# Altium project SVPXFMC_Carrier_6U.PrjPcb (part 1 of 9)
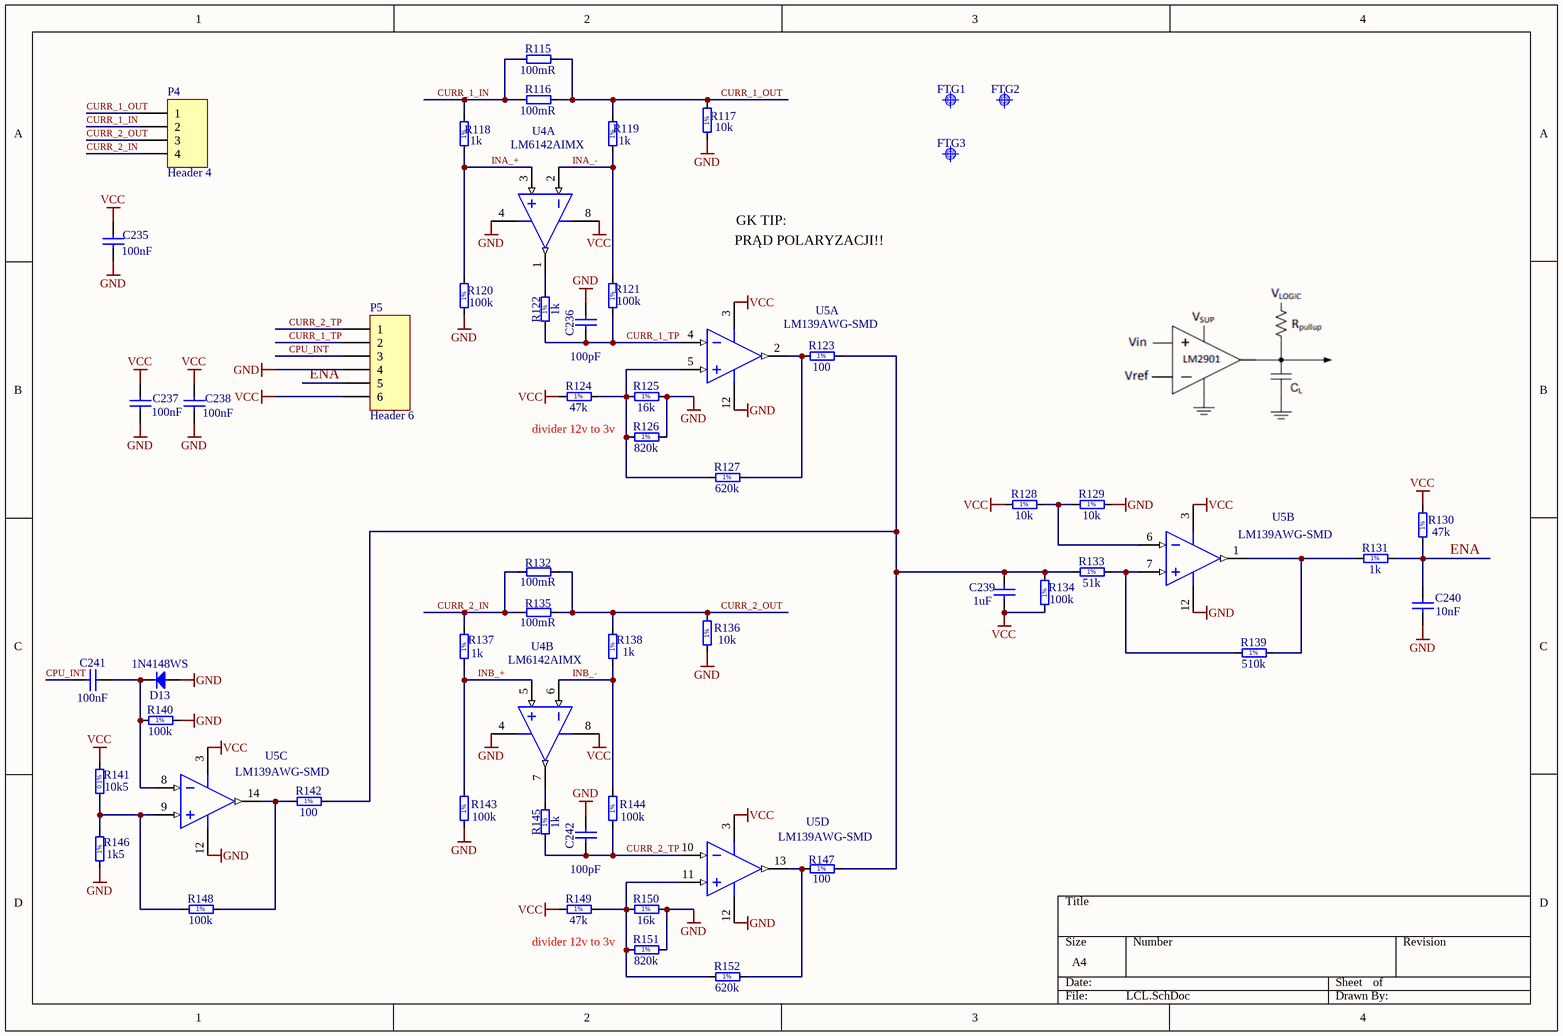
[diagram p0: LCL.SchDoc]
ProjectAddress1: IBP Shanghai; ProjectAddress2: Level 3 - Building 3; ProjectAddress3: No.168 Linhong Road; ProjectAddress4: Shanghai 200335, China; ProjectOrganization: Altium; ProjectTitle: VPX 6U; Template Family: VPX; Template Notes: - Nominal values used, all dimensions are mm.  - Stackup is not specified in AV46DOT0.PDF, nor implemented in this template.  - The component height constraint is defined in AV46DOT0.pdf, page 90.; Template Revision Date: May 2011; Template Source Document: AV46DOT0.pdf; Template Source Name: ANSI/VITA 46.0-2007; Template Source Organization: VITA; Template Source Revision Date: Oct-2007; Template Source URL: www.vita.com
22 sheets, 996 parts. Net scope: hierarchical (ports join the sheet entries above them; power ports are global).
Board file: SVPXFMC_Carrier_6U.PcbDoc
Sheets:
  LCL.SchDoc
  LCL_sch.SchDoc
  SVPXFMC_Carrier_6U.SchDoc
    FMC Carrier Channel1 = FMC_Carrier_channel.SchDoc
      U_FMC_connector = FMC_connector.SchDoc
      FPGA_FMC = FPGA_FMC.SchDoc
      FPGA_RGMII_Misc = FPGA_RGMII_Misc.SchDoc
      FPGA_MGT = FPGA_MGT.SchDoc
      Supply for FPGA, FMC and SDRAM = Channel_supply.SchDoc
      U_FPGA SDRAM bank = FPGA SDRAM bank.SchDoc
      U_FPGA Supply = FPGA Supply.SchDoc
      U_DDR4 SDRAM = DDR4 SDRAM.SchDoc
      FPGA config = FPGA_Config.SchDoc
      U_Decoupling_caps = Decoupling_caps.SchDoc
      U_CAN_IFC = CAN_IFC.SchDoc
    FMC Carrier Channel2 = FMC_Carrier_channel.SchDoc
      U_FMC_connector = FMC_connector.SchDoc
      FPGA_FMC = FPGA_FMC.SchDoc
      FPGA_RGMII_Misc = FPGA_RGMII_Misc.SchDoc
      FPGA_MGT = FPGA_MGT.SchDoc
      Supply for FPGA, FMC and SDRAM = Channel_supply.SchDoc
      U_FPGA SDRAM bank = FPGA SDRAM bank.SchDoc
      U_FPGA Supply = FPGA Supply.SchDoc
      U_DDR4 SDRAM = DDR4 SDRAM.SchDoc
      FPGA config = FPGA_Config.SchDoc
      U_Decoupling_caps = Decoupling_caps.SchDoc
      U_CAN_IFC = CAN_IFC.SchDoc
    U_HDN_Control_Data = HDN_Control_Data.SchDoc
    U_HDN_Management = HDN_Management.SchDoc
    U_MSP_Telemetry = MSP_Telemetry.SchDoc
      U_MSP_Power_Program = MSP_Power_Program.SchDoc
    Module supply = Module_Supply.SchDoc
    U_FRAM_memory = FRAM_memory.SchDoc
    Interface_prot_A = Interface_Protection.SchDoc
    Interface_prot_B = Interface_Protection.SchDoc

## Sheet LCL.SchDoc: NIC POWER LCL prototype
size A4; DrawnBy: Marcin Bieda, Daniel Kaczmara; Revision: 1.0

### Parts
C235  100nF  [CAPC1608X87N]
C236  100pF  [CAPC1608X87N]
C237  100nF  [CAPC1608X87N]
C238  100nF  [CAPC1608X87N]
C239  1uF  [CAPC1608X87N]
C240  10nF  [CAPC1608X87N]
C241  100nF  [CAPC1608X87N]
C242  100pF  [CAPC1608X87N]
D13  1N4148WS  [SODFL2512X100N]
FTG1  Use only in PCB  [FIDUCIAL_TOP_C100-200]  (value not drawn)
FTG2  Use only in PCB  [FIDUCIAL_TOP_C100-200]  (value not drawn)
FTG3  Use only in PCB  [FIDUCIAL_TOP_C100-200]  (value not drawn)
P4  Header 4  [1x4 Header 2mm male]
P5  Header 6  [2x3 Header 2mm male]
R115  100mR  [RESC1608X55N]
R116  100mR  [RESC1608X55N]
R117  10k  [RESC1608X55N]
R118  1k  [RESC1608X55N]
R119  1k  [RESC1608X55N]
R120  100k  [RESC1608X55N]
R121  100k  [RESC1608X55N]
R122  1k  [RESC1608X55N]
R123  100  [RESC1608X55N]
R124  47k  [RESC1608X55N]
R125  16k  [RESC1608X55N]
R126  820k  [RESC1608X55N]
R127  620k  [RESC1608X55N]
R128  10k  [RESC1608X55N]
R129  10k  [RESC1608X55N]
R130  47k  [RESC1608X55N]
R131  1k  [RESC1608X55N]
R132  100mR  [RESC1608X55N]
R133  51k  [RESC1608X55N]
R134  100k  [RESC1608X55N]
R135  100mR  [RESC1608X55N]
R136  10k  [RESC1608X55N]
R137  1k  [RESC1608X55N]
R138  1k  [RESC1608X55N]
R139  510k  [RESC1608X55N]
R140  100k  [RESC1608X55N]
R141  10k5  [RESC1608X55N]
R142  100  [RESC1608X55N]
R143  100k  [RESC1608X55N]
R144  100k  [RESC1608X55N]
R145  1k  [RESC1608X55N]
R146  1k5  [RESC1608X55N]
R147  100  [RESC1608X55N]
R148  100k  [RESC1608X55N]
R149  47k  [RESC1608X55N]
R150  16k  [RESC1608X55N]
R151  820k  [RESC1608X55N]
R152  620k  [RESC1608X55N]
U4  LM6142AIMX  [M08A_N]  (parts A,B of 2)
U5  LM139AWG-SMD  [WG14A_N]  (parts A,B,C,D of 4)

### Nets
GND: C235.1 C236.2 C237.1 C238.1 C240.1 C242.2 D13.2(A) P5.4 R117.1 R120.1 R125.2 R126.2 R129.2 R136.1 R140.2 R143.1 R146.1 R150.2 R151.2 U4.4(V-) U5.12(GND)
VCC: C235.2 C237.2 C238.2 C239.1 P5.6 R124.1 R128.1 R130.2 R134.1 R141.2 R149.1 U4.8(V+) U5.3(V+)
CPU_INT: C241.1 P5.3
CURR_1_IN: P4.2 R115.1 R116.1 R118.2
CURR_1_OUT: P4.1 R115.2 R116.2 R117.2 R119.2
CURR_1_TP: C236.1 P5.2 R121.1 R122.1 U5.4(IN1-)
CURR_2_IN: P4.4 R132.1 R135.1 R137.2
CURR_2_OUT: P4.3 R132.2 R135.2 R136.2 R138.2
CURR_2_TP: C242.1 P5.1 R144.1 R145.1 U5.10(IN4-)
ENA: C240.2 P5.5 R130.1 R131.2
INA_+: R118.1 R120.2 U4.3(INA+)
INA_-: R119.1 R121.2 U4.2(INA-)
INB_+: R137.1 R143.2 U4.5(INB+)
INB_-: R138.1 R144.2 U4.6(INB-)
NetC239_2: C239.2 R123.2 R133.1 R134.2 R142.2 R147.2
NetC241_2: C241.2 D13.1(C) R140.1 U5.8(IN3-)
NetR122_2: R122.2 U4.1(OUTA)
NetR123_1: R123.1 R127.2 U5.2(OUT1)
NetR124_2: R124.2 R125.1 R126.1 R127.1 U5.5(IN1+)
NetR128_2: R128.2 R129.1 U5.6(IN2-)
NetR131_1: R131.1 R139.2 U5.1(OUT2)
NetR133_2: R133.2 R139.1 U5.7(IN2+)
NetR141_1: R141.1 R146.2 R148.1 U5.9(IN3+)
NetR142_1: R142.1 R148.2 U5.14(OUT3)
NetR145_2: R145.2 U4.7(OUTB)
NetR147_1: R147.1 R152.2 U5.13(OUT4)
NetR149_2: R149.2 R150.1 R151.1 R152.1 U5.11(IN4+)

### Notes on the sheet
- PRĄD POLARYZACJI!!
- GK TIP:
- (near R126) divider 12v to 3v
- (near R151) divider 12v to 3v
- (in symbol R0603_1K5_1%_0.1W_100PPM) 1%
- (in symbol R0603_1K_1%_0.1W_100PPM) 1%
- (in symbol R0603_10K5_0.1%_0.063W_10PPM) 0.1%
- (in symbol R0603_10K_1%_0.1W_100PPM) 1%
- (in symbol R0603_16K_1%_0.1W_100PPM) 1%
- (in symbol R0603_47K_1%_0.1W_100PPM) 1%
- (in symbol R0603_51K_1%_0.1W_100PPM) 1%
- (in symbol R0603_100K_1%_0.1W_100PPM) 1%
- (in symbol R0603_100R_1%_0.1W_100PPM) 1%
- (in symbol R0603_510K_1%_0.1W_100PPM) 1%
- (in symbol R0603_620K_1%_0.1W_100PPM) 1%
- (in symbol R0603_820K_1%_0.1W_100PPM) 1%

### Library data of the parts
C235 C237 C238 C241 = CC0603_100NF_50V_10%_X7R: Non-polarised capacitor; Part Description: SMD Multilayer Chip Ceramic Capacitor; Manufacturer: GENERIC; Manufacturer1 Part Number: 223858615649; Voltage: 50V; TC: X7R; Tolerance: ±10%; Part Number: CC0603_100NF_50V_10%_X7R; Component Kind: Standard; Component Type: Standard; Pin Count: 2; Value: 100nF; Status: Preferred; Manufacturer Part Number: CC0603_100NF_50V_10%_X7R; Case: 0603; Mounted: Yes; Socket: No; SMD: Yes; Sense: No; Manufacturer1 Example: PHYCOMP; Manufacturer1 ComponentHeight: 0.87mm; HelpURL: \\cern.ch\dfs\Applications\Altium\Datasheets\CC0603_X7R_PHYCOMP.pdf; Author: CERN DEM JLC; CreateDate: 2007-12-03; LatestRevisionDate: 2007-12-03
C236 C242 = CC0603_100PF_50V_10%_X7R: Non-polarised capacitor; Part Description: SMD Multilayer Chip Ceramic Capacitor; Manufacturer: GENERIC; Manufacturer1 Part Number: 223858615609; Voltage: 50V; TC: X7R; Tolerance: ±10%; Part Number: CC0603_100PF_50V_10%_X7R; Component Kind: Standard; Component Type: Standard; Pin Count: 2; Value: 100pF; Status: Preferred; Manufacturer Part Number: CC0603_100PF_50V_10%_X7R; Case: 0603; Mounted: Yes; Socket: No; SMD: Yes; Sense: No; Manufacturer1 Example: PHYCOMP; Manufacturer1 ComponentHeight: 0.9mm; HelpURL: \\cern.ch\dfs\Applications\Altium\Datasheets\CC0603_X7R_PHYCOMP.pdf; Author: CERN DEM JLC; CreateDate: 2012-08-15; LatestRevisionDate: 2012-08-15
C239 = CC0603_1UF_25V_10%_X7R: Non-polarised capacitor; Part Description: SMD Multilayer Chip Ceramic Capacitor; Manufacturer: GENERIC; Manufacturer1 Part Number: GRM188R71E105KA12D; Voltage: 25V; TC: X7R; Tolerance: ±10%; Part Number: CC0603_1UF_25V_10%_X7R; Component Kind: Standard; Component Type: Standard; Pin Count: 2; Value: 1uF; Status: None; Manufacturer Part Number: CC0603_1UF_25V_10%_X7R; Case: 0603; Mounted: Yes; Socket: No; SMD: Yes; Sense: No; Manufacturer1 Example: MURATA; Manufacturer1 ComponentHeight: 0.9mm; HelpURL: \\cern.ch\dfs\Applications\Altium\Datasheets\CC0603_X7R_MURATA.pdf; Author: CERN DEM JLC; CreateDate: 2011-01-18; LatestRevisionDate: 2011-01-18
C240 = CC0603_10NF_50V_10%_X7R: Non-polarised capacitor; Part Description: SMD Multilayer Chip Ceramic Capacitor; Manufacturer: GENERIC; Manufacturer1 Part Number: 223858615636; Voltage: 50V; TC: X7R; Tolerance: ±10%; Part Number: CC0603_10NF_50V_10%_X7R; Component Kind: Standard; Component Type: Standard; Pin Count: 2; Value: 10nF; Status: Preferred; Manufacturer Part Number: CC0603_10NF_50V_10%_X7R; Case: 0603; Mounted: Yes; Socket: No; SMD: Yes; Sense: No; Manufacturer1 Example: PHYCOMP; Manufacturer1 ComponentHeight: 0.87mm; HelpURL: \\cern.ch\dfs\Applications\Altium\Datasheets\CC0603_X7R_PHYCOMP.pdf; Author: CERN DEM JLC; CreateDate: 2007-12-03; LatestRevisionDate: 2007-12-03
D13 = 1N4148WS: Diode; Part Description: Small Signal Diodes; Manufacturer: FAIRCHILD SEMICONDUCTOR; Voltage: 75V; Power: 150mA; PressFit: No; Bonding: No; Part Number: 1N4148WS; Component Kind: Standard; Component Type: Standard; Device: 1N4148WS; PackageDescription: SODFL Diode; 1.70mm W X 1.25mm L X 1.00mm H body, IPC Medium Density; Manufacturer Part Number: 1N4148WS; Pin Count: 2; Case: SOD-323F; Mounted: Yes; Socket: No; SMD: Yes; Sense: No; ComponentHeight: 1mm; HelpURL: \\cern.ch\dfs\Applications\Altium\Datasheets\1N4148WS.pdf; Author: CERN DEM JLC; CreateDate: 2011-05-12; LatestRevisionDate: 2011-05-12
FTG1-FTG3 = FIDUCIAL_TARGET_C100-200: Fiducial Target; Part Description: Round Fiducial Target, Top Layer, 1.0mm, Top Solder 2.0mm, Keepout =2.0mm; Mounted: No; Part Number: FIDUCIAL_TARGET_C100-200; Component Kind: Standard (No BOM); Component Type: Standard (No BOM); Pin Count: 1; Family: Fiducial; Socket: No; SMD: Yes; Sense: No; Status: None; ComponentHeight: 0mm; HelpURL: Undefined; Author: CERN DEM JLC; CreateDate: 2010-02-09; LatestRevisionDate: 2012-04-04; PackageDescription: Round Fiducial Target, Top Layer, 1.0mm, Top Solder 2.0mm, Keepout =2.0mm
P4 = Header 4: Header, 4-Pin; LatestRevisionDate: 17-Jul-2002; LatestRevisionNote: Re-released for DXP Platform.; Publisher: Altium Limited
P5 = Header 6: Header, 6-Pin; LatestRevisionDate: 17-Jul-2002; LatestRevisionNote: Re-released for DXP Platform.; Publisher: Altium Limited
R115 R116 R132 R135 = R0603_0R_JUMPER: Resistor; Part Number: 100mR 0603; Part Description: 1A (0.05R Max DC Resistance) Zero Ohm Jumper; Manufacturer: GENERIC; Manufacturer1 Part Number: NRC06Z0; Value: 0; PressFit: No; Component Kind: Standard; Component Type: Standard; Pin Count: 2; Status: Preferred; Manufacturer Part Number: R0603_0R_JUMPER; Case: 0603; Mounted: Yes; Sense: No; Socket: No; SMD: Yes; Manufacturer1 Example: NIC COMPONENT; Manufacturer1 ComponentHeight: 0.55mm; HelpURL: \\cern.ch\dfs\Applications\Altium\Datasheets\R0603_NIC_NRC.pdf; Author: CERN DEM JLC; CreateDate: 2007-12-03; LatestRevisionDate: 2008-03-13
R117 R128 R129 R136 = R0603_10K_1%_0.1W_100PPM: Resistor - 1%; Part Description: General Purpose Thick Film Chip Resistor; Manufacturer: GENERIC; Manufacturer1 Part Number: NRC06F1002TRF; Power: 0.1W; TC: ±100ppm/°C; PressFit: No; Part Number: R0603_10K_1%_0.1W_100PPM; Component Kind: Standard; Component Type: Standard; Pin Count: 2; Value: 10k; Status: Preferred; Tolerance: ±1%; Manufacturer Part Number: R0603_10K_1%_0.1W_100PPM; Case: 0603; Mounted: Yes; Sense: No; Socket: No; SMD: Yes; Manufacturer1 Example: NIC COMPONENT; Manufacturer1 ComponentHeight: 0.55mm; HelpURL: \\cern.ch\dfs\Applications\Altium\Datasheets\R0603_NIC_NRC.pdf; Author: CERN DEM JLC; CreateDate: 2007-12-03; LatestRevisionDate: 2008-03-13
R118 R119 R122 R131 R137 R138 R145 = R0603_1K_1%_0.1W_100PPM: Resistor - 1%; Part Description: General Purpose Thick Film Chip Resistor; Manufacturer: GENERIC; Manufacturer1 Part Number: NRC06F1001TRF; Power: 0.1W; TC: ±100ppm/°C; PressFit: No; Part Number: R0603_1K_1%_0.1W_100PPM; Component Kind: Standard; Component Type: Standard; Pin Count: 2; Value: 1k; Status: Preferred; Tolerance: ±1%; Manufacturer Part Number: R0603_1K_1%_0.1W_100PPM; Case: 0603; Mounted: Yes; Sense: No; Socket: No; SMD: Yes; Manufacturer1 Example: NIC COMPONENT; Manufacturer1 ComponentHeight: 0.55mm; HelpURL: \\cern.ch\dfs\Applications\Altium\Datasheets\R0603_NIC_NRC.pdf; Author: CERN DEM JLC; CreateDate: 2007-12-03; LatestRevisionDate: 2008-03-13
R120 R121 R134 R140 R143 R144 R148 = R0603_100K_1%_0.1W_100PPM: Resistor - 1%; Part Description: General Purpose Thick Film Chip Resistor; Manufacturer: GENERIC; Manufacturer1 Part Number: NRC06F1003TRF; Power: 0.1W; TC: ±100ppm/°C; PressFit: No; Part Number: R0603_100K_1%_0.1W_100PPM; Component Kind: Standard; Component Type: Standard; Pin Count: 2; Value: 100k; Status: Preferred; Tolerance: ±1%; Manufacturer Part Number: R0603_100K_1%_0.1W_100PPM; Case: 0603; Mounted: Yes; Sense: No; Socket: No; SMD: Yes; Manufacturer1 Example: NIC COMPONENT; Manufacturer1 ComponentHeight: 0.55mm; HelpURL: \\cern.ch\dfs\Applications\Altium\Datasheets\R0603_NIC_NRC.pdf; Author: CERN DEM JLC; CreateDate: 2007-12-03; LatestRevisionDate: 2008-03-13
R123 R142 R147 = R0603_100R_1%_0.1W_100PPM: Resistor - 1%; Part Description: General Purpose Thick Film Chip Resistor; Manufacturer: GENERIC; Manufacturer1 Part Number: NRC06F4700TRF; Power: 0.1W; TC: ±100ppm/°C; PressFit: No; Part Number: R0603_100R_1%_0.1W_100PPM; Component Kind: Standard; Component Type: Standard; Pin Count: 2; Value: 100; Status: Preferred; Tolerance: ±1%; Manufacturer Part Number: R0603_100R_1%_0.1W_100PPM; Case: 0603; Mounted: Yes; Sense: No; Socket: No; SMD: Yes; Manufacturer1 Example: NIC COMPONENT; Manufacturer1 ComponentHeight: 0.55mm; HelpURL: \\cern.ch\dfs\Applications\Altium\Datasheets\R0603_NIC_NRC.pdf; Author: CERN DEM JLC; CreateDate: 2007-12-03; LatestRevisionDate: 2008-03-13
R124 R130 R149 = R0603_47K_1%_0.1W_100PPM: Resistor - 1%; Part Description: General Purpose Thick Film Chip Resistor; Manufacturer: GENERIC; Manufacturer1 Part Number: NRC06F4702TRF; Power: 0.1W; TC: ±100ppm/°C; PressFit: No; Part Number: R0603_47K_1%_0.1W_100PPM; Component Kind: Standard; Component Type: Standard; Pin Count: 2; Value: 47k; Status: Preferred; Tolerance: ±1%; Manufacturer Part Number: R0603_47K_1%_0.1W_100PPM; Case: 0603; Mounted: Yes; Sense: No; Socket: No; SMD: Yes; Manufacturer1 Example: NIC COMPONENT; Manufacturer1 ComponentHeight: 0.55mm; HelpURL: \\cern.ch\dfs\Applications\Altium\Datasheets\R0603_NIC_NRC.pdf; Author: CERN DEM JLC; CreateDate: 2007-12-03; LatestRevisionDate: 2008-03-13
R125 R150 = R0603_16K_1%_0.1W_100PPM: Resistor - 1%; Part Description: General Purpose Thick Film Chip Resistor; Manufacturer: GENERIC; Manufacturer1 Part Number: NRC06F1602TRF; Power: 0.1W; TC: ±100ppm/°C; PressFit: No; Part Number: R0603_16K_1%_0.1W_100PPM; Component Kind: Standard; Component Type: Standard; Pin Count: 2; Value: 16k; Status: Preferred; Tolerance: ±1%; Manufacturer Part Number: R0603_16K_1%_0.1W_100PPM; Case: 0603; Mounted: Yes; Sense: No; Socket: No; SMD: Yes; Manufacturer1 Example: NIC COMPONENT; Manufacturer1 ComponentHeight: 0.55mm; HelpURL: \\cern.ch\dfs\Applications\Altium\Datasheets\R0603_NIC_NRC.pdf; Author: CERN DEM JLC; CreateDate: 2007-12-03; LatestRevisionDate: 2008-03-13
R126 R151 = R0603_820K_1%_0.1W_100PPM: Resistor - 1%; Part Description: General Purpose Thick Film Chip Resistor; Manufacturer: GENERIC; Manufacturer1 Part Number: NRC06F8203TRF; Power: 0.1W; TC: ±100ppm/°C; PressFit: No; Part Number: R0603_820K_1%_0.1W_100PPM; Component Kind: Standard; Component Type: Standard; Pin Count: 2; Value: 820k; Status: Preferred; Tolerance: ±1%; Manufacturer Part Number: R0603_820K_1%_0.1W_100PPM; Case: 0603; Mounted: Yes; Sense: No; Socket: No; SMD: Yes; Manufacturer1 Example: NIC COMPONENT; Manufacturer1 ComponentHeight: 0.55mm; HelpURL: \\cern.ch\dfs\Applications\Altium\Datasheets\R0603_NIC_NRC.pdf; Author: CERN DEM JLC; CreateDate: 2007-12-03; LatestRevisionDate: 2008-03-13
R127 R152 = R0603_620K_1%_0.1W_100PPM: Resistor - 1%; Part Description: General Purpose Thick Film Chip Resistor; Manufacturer: GENERIC; Manufacturer1 Part Number: NRC06F6203TRF; Power: 0.1W; TC: ±100ppm/°C; PressFit: No; Part Number: R0603_620K_1%_0.1W_100PPM; Component Kind: Standard; Component Type: Standard; Pin Count: 2; Value: 620k; Status: Preferred; Tolerance: ±1%; Manufacturer Part Number: R0603_620K_1%_0.1W_100PPM; Case: 0603; Mounted: Yes; Sense: No; Socket: No; SMD: Yes; Manufacturer1 Example: NIC COMPONENT; Manufacturer1 ComponentHeight: 0.55mm; HelpURL: \\cern.ch\dfs\Applications\Altium\Datasheets\R0603_NIC_NRC.pdf; Author: CERN DEM JLC; CreateDate: 2007-12-03; LatestRevisionDate: 2008-03-13
R133 = R0603_51K_1%_0.1W_100PPM: Resistor - 1%; Part Description: General Purpose Thick Film Chip Resistor; Manufacturer: GENERIC; Manufacturer1 Part Number: NRC06F5102TRF; Power: 0.1W; TC: ±100ppm/°C; PressFit: No; Part Number: R0603_51K_1%_0.1W_100PPM; Component Kind: Standard; Component Type: Standard; Pin Count: 2; Value: 51k; Status: Preferred; Tolerance: ±1%; Manufacturer Part Number: R0603_51K_1%_0.1W_100PPM; Case: 0603; Mounted: Yes; Sense: No; Socket: No; SMD: Yes; Manufacturer1 Example: NIC COMPONENT; Manufacturer1 ComponentHeight: 0.55mm; HelpURL: \\cern.ch\dfs\Applications\Altium\Datasheets\R0603_NIC_NRC.pdf; Author: CERN DEM JLC; CreateDate: 2007-12-03; LatestRevisionDate: 2008-03-13
R139 = R0603_510K_1%_0.1W_100PPM: Resistor - 1%; Part Description: General Purpose Thick Film Chip Resistor; Manufacturer: GENERIC; Manufacturer1 Part Number: NRC06F5103TRF; Power: 0.1W; TC: ±100ppm/°C; PressFit: No; Part Number: R0603_510K_1%_0.1W_100PPM; Component Kind: Standard; Component Type: Standard; Pin Count: 2; Value: 510k; Status: Preferred; Tolerance: ±1%; Manufacturer Part Number: R0603_510K_1%_0.1W_100PPM; Case: 0603; Mounted: Yes; Sense: No; Socket: No; SMD: Yes; Manufacturer1 Example: NIC COMPONENT; Manufacturer1 ComponentHeight: 0.55mm; HelpURL: \\cern.ch\dfs\Applications\Altium\Datasheets\R0603_NIC_NRC.pdf; Author: CERN DEM JLC; CreateDate: 2007-12-03; LatestRevisionDate: 2008-03-13
R141 = R0603_10K5_0.1%_0.063W_10PPM: Resistor - 0.1%; Part Description: Thin Film Chip Resistor; Manufacturer: GENERIC; Manufacturer1 Part Number: RN73C1J10K5BTDF; Power: 0.063W; TC: ±10ppm; PressFit: No; Part Number: R0603_10K5_0.1%_0.063W_10PPM; Component Kind: Standard; Component Type: Standard; Pin Count: 2; Value: 10k5; Status: Not Recommended; Tolerance: ±0.1%; Manufacturer Part Number: R0603_10K5_0.1%_0.063W_10PPM; Case: 0603; Mounted: Yes; Sense: No; Socket: No; SMD: Yes; Manufacturer1 Example: TYCO HOLSWORTHY; Manufacturer1 ComponentHeight: 0.5mm; HelpURL: \\cern.ch\dfs\Applications\Altium\Datasheets\R0603_Tyco_RN73.pdf; Author: CERN DEM JLC; CreateDate: 2007-12-03; LatestRevisionDate: 2008-03-13
R146 = R0603_1K5_1%_0.1W_100PPM: Resistor - 1%; Part Description: General Purpose Thick Film Chip Resistor; Manufacturer: GENERIC; Manufacturer1 Part Number: NRC06F1501TRF; Power: 0.1W; TC: ±100ppm/°C; PressFit: No; Part Number: R0603_1K5_1%_0.1W_100PPM; Component Kind: Standard; Component Type: Standard; Pin Count: 2; Value: 1k5; Status: Preferred; Tolerance: ±1%; Manufacturer Part Number: R0603_1K5_1%_0.1W_100PPM; Case: 0603; Mounted: Yes; Sense: No; Socket: No; SMD: Yes; Manufacturer1 Example: NIC COMPONENT; Manufacturer1 ComponentHeight: 0.55mm; HelpURL: \\cern.ch\dfs\Applications\Altium\Datasheets\R0603_NIC_NRC.pdf; Author: CERN DEM JLC; CreateDate: 2007-12-03; LatestRevisionDate: 2008-03-13
U4 = LM6142AIMX: Dual High Speed/Low Power 17 MHz Rail-to-Rail I/O Operational Amplifier, 8-pin Narrow SOIC; Manufacturer: National Semiconductor; PackageTopMarking: NSZXTT*LM614*2AIM; PowerWise: N; CompType: Amplifiers; High-Reliability: Y; DatasheetVersion: Nov-2004; PackageVersion: revM, May-2009; PackageReference: M08A; PackageDescription: SOIC Narrow, 4.9 x 3.9 x 1.45mm, 8 Lead, 1.27mm Pitch; PartNumber: LM6142AIMX; RoHS: N; PinCount: 8; Code_JEDEC: MS-012-AA; Code_IPC: SOIC127P600-8; ComponentLink1Description: Manufacturer URL; ComponentLink1URL: http://www.national.com/; ComponentLink2Description: LM6142 Datasheet; ComponentLink2URL: http://www.national.com/ds/LM/LM6142.pdf; ComponentLink3Description: LM6142 Web Page; ComponentLink3URL: http://www.national.com/pf/LM/LM6142.html; ComponentLink4Description: M08A Package Page; ComponentLink4URL: http://www.national.com/packaging/folders/m08a.html
U5 = LM139AWG-SMD: Low Power Low Offset Voltage Quad Comparator, 14-pin CerPACK; Manufacturer: National Semiconductor; PackageTopMarking: NSZSSXXYYA*5962-*8773901XA Q; PowerWise: N; CompType: Amplifiers; High-Reliability: Y; DatasheetVersion: Mar-2004; PackageVersion: revD, Jul-2007; PackageReference: WG14A; PackageDescription: Cerpack, .390 x .250 x .070in, 14 Lead, .050in Pitch, Gull Wing; PartNumber: LM139AWG-SMD; RoHS: N; PinCount: 14; ComponentLink1Description: Manufacturer URL; ComponentLink1URL: http://www.national.com/; ComponentLink2Description: LM139A Datasheet; ComponentLink2URL: http://www.national.com/ds/LM/LM139AQML.pdf; ComponentLink3Description: LM139A Web Page; ComponentLink3URL: http://www.national.com/pf/LM/LM139A.html; ComponentLink4Description: WG14A Package Page; ComponentLink4URL: http://www.national.com/packaging/folders/wg14a.html

## Sheet LCL_sch.SchDoc: NIC POWER LCL prototype
size A4; DrawnBy: Marcin Bieda, Daniel Kaczmara; Revision: 1.0
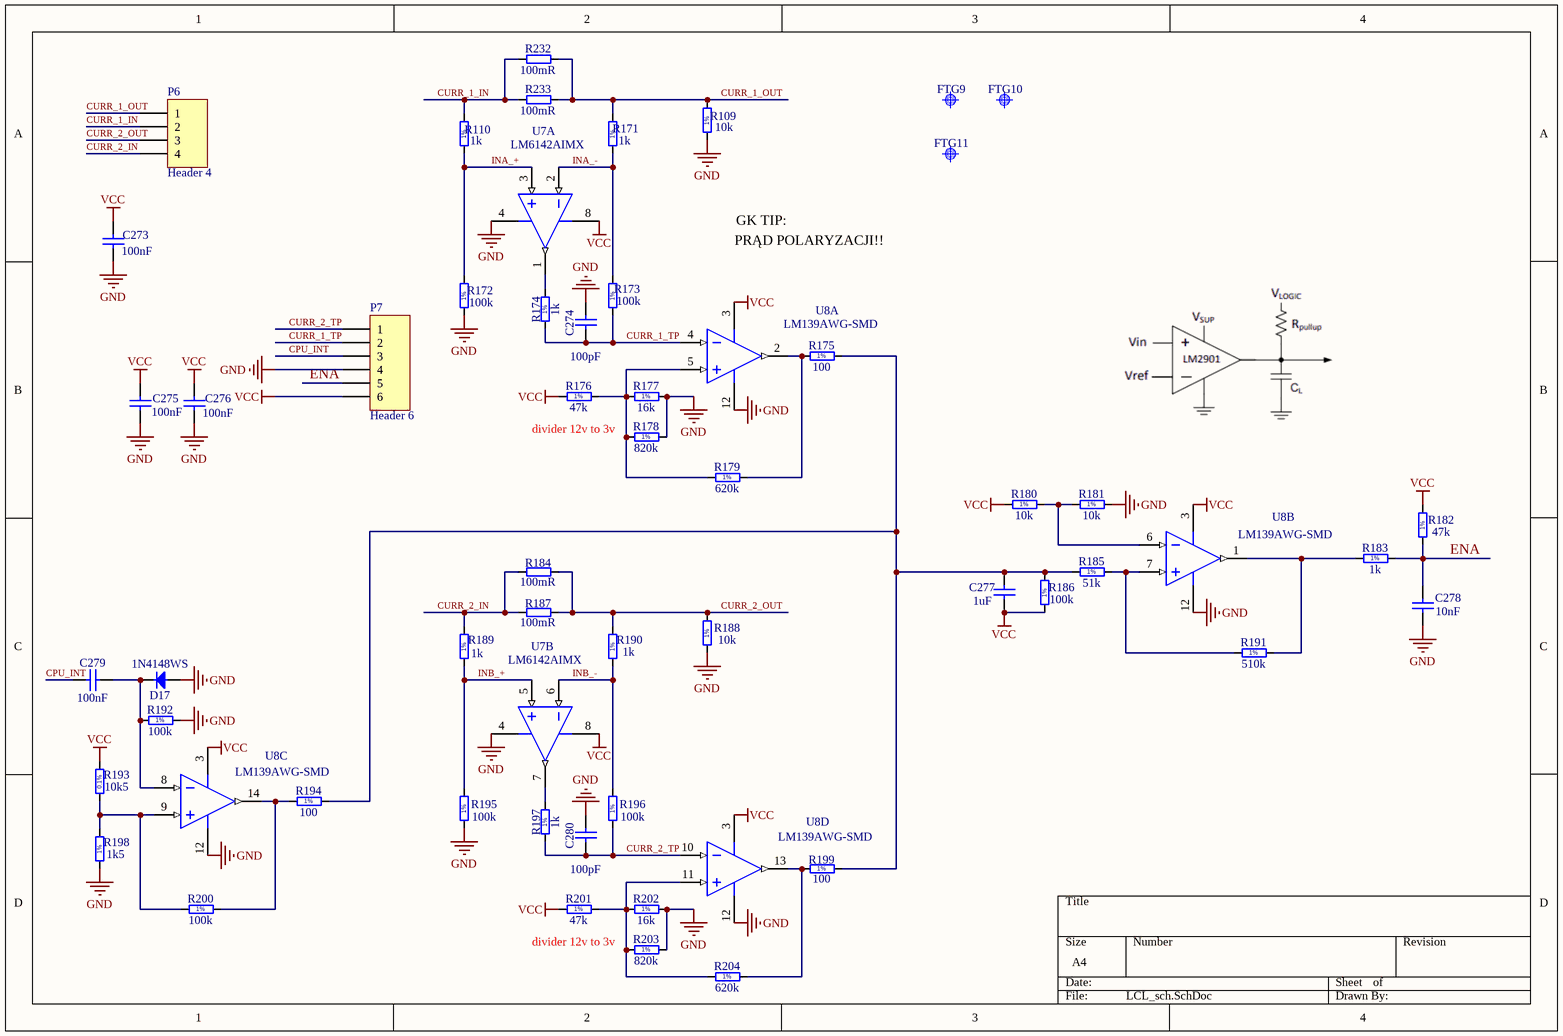
[diagram p1: LCL_sch.SchDoc]

### Parts
C273  100nF  [CAPC1608X87N]
C274  100pF  [CAPC1608X87N]
C275  100nF  [CAPC1608X87N]
C276  100nF  [CAPC1608X87N]
C277  1uF  [CAPC1608X87N]
C278  10nF  [CAPC1608X87N]
C279  100nF  [CAPC1608X87N]
C280  100pF  [CAPC1608X87N]
D17  1N4148WS  [SODFL2512X100N]
FTG9  Use only in PCB  [FIDUCIAL_TOP_C100-200]  (value not drawn)
FTG10  Use only in PCB  [FIDUCIAL_TOP_C100-200]  (value not drawn)
FTG11  Use only in PCB  [FIDUCIAL_TOP_C100-200]  (value not drawn)
P6  Header 4  [1x4 Header 2mm male]
P7  Header 6  [2x3 Header 2mm male]
R109  10k  [RESC1608X55N]
R110  1k  [RESC1608X55N]
R171  1k  [RESC1608X55N]
R172  100k  [RESC1608X55N]
R173  100k  [RESC1608X55N]
R174  1k  [RESC1608X55N]
R175  100  [RESC1608X55N]
R176  47k  [RESC1608X55N]
R177  16k  [RESC1608X55N]
R178  820k  [RESC1608X55N]
R179  620k  [RESC1608X55N]
R180  10k  [RESC1608X55N]
R181  10k  [RESC1608X55N]
R182  47k  [RESC1608X55N]
R183  1k  [RESC1608X55N]
R184  100mR  [RESC1608X55N]
R185  51k  [RESC1608X55N]
R186  100k  [RESC1608X55N]
R187  100mR  [RESC1608X55N]
R188  10k  [RESC1608X55N]
R189  1k  [RESC1608X55N]
R190  1k  [RESC1608X55N]
R191  510k  [RESC1608X55N]
R192  100k  [RESC1608X55N]
R193  10k5  [RESC1608X55N]
R194  100  [RESC1608X55N]
R195  100k  [RESC1608X55N]
R196  100k  [RESC1608X55N]
R197  1k  [RESC1608X55N]
R198  1k5  [RESC1608X55N]
R199  100  [RESC1608X55N]
R200  100k  [RESC1608X55N]
R201  47k  [RESC1608X55N]
R202  16k  [RESC1608X55N]
R203  820k  [RESC1608X55N]
R204  620k  [RESC1608X55N]
R232  100mR  [RESC1608X55N]
R233  100mR  [RESC1608X55N]
U7  LM6142AIMX  [M08A_N]  (parts A,B of 2)
U8  LM139AWG-SMD  [WG14A_N]  (parts A,B,C,D of 4)

### Nets
GND: C273.1 C274.2 C275.1 C276.1 C278.1 C280.2 D17.2(A) P7.4 R109.1 R172.1 R177.2 R178.2 R181.2 R188.1 R192.2 R195.1 R198.1 R202.2 R203.2 U7.4(V-) U8.12(GND)
VCC: C273.2 C275.2 C276.2 C277.1 P7.6 R176.1 R180.1 R182.2 R186.1 R193.2 R201.1 U7.8(V+) U8.3(V+)
CPU_INT: C279.1 P7.3
CURR_1_IN: P6.2 R110.2 R232.1 R233.1
CURR_1_OUT: P6.1 R109.2 R171.2 R232.2 R233.2
CURR_1_TP: C274.1 P7.2 R173.1 R174.1 U8.4(IN1-)
CURR_2_IN: P6.4 R184.1 R187.1 R189.2
CURR_2_OUT: P6.3 R184.2 R187.2 R188.2 R190.2
CURR_2_TP: C280.1 P7.1 R196.1 R197.1 U8.10(IN4-)
ENA: C278.2 P7.5 R182.1 R183.2
INA_+: R110.1 R172.2 U7.3(INA+)
INA_-: R171.1 R173.2 U7.2(INA-)
INB_+: R189.1 R195.2 U7.5(INB+)
INB_-: R190.1 R196.2 U7.6(INB-)
NetC277_2: C277.2 R175.2 R185.1 R186.2 R194.2 R199.2
NetC279_2: C279.2 D17.1(C) R192.1 U8.8(IN3-)
NetR174_2: R174.2 U7.1(OUTA)
NetR175_1: R175.1 R179.2 U8.2(OUT1)
NetR176_2: R176.2 R177.1 R178.1 R179.1 U8.5(IN1+)
NetR180_2: R180.2 R181.1 U8.6(IN2-)
NetR183_1: R183.1 R191.2 U8.1(OUT2)
NetR185_2: R185.2 R191.1 U8.7(IN2+)
NetR193_1: R193.1 R198.2 R200.1 U8.9(IN3+)
NetR194_1: R194.1 R200.2 U8.14(OUT3)
NetR197_2: R197.2 U7.7(OUTB)
NetR199_1: R199.1 R204.2 U8.13(OUT4)
NetR201_2: R201.2 R202.1 R203.1 R204.1 U8.11(IN4+)

### Notes on the sheet
- PRĄD POLARYZACJI!!
- GK TIP:
- (near R178) divider 12v to 3v
- (near R203) divider 12v to 3v
- (in symbol R0603_1K5_1%_0.1W_100PPM) 1%
- (in symbol R0603_1K_1%_0.1W_100PPM) 1%
- (in symbol R0603_10K5_0.1%_0.063W_10PPM) 0.1%
- (in symbol R0603_10K_1%_0.1W_100PPM) 1%
- (in symbol R0603_16K_1%_0.1W_100PPM) 1%
- (in symbol R0603_47K_1%_0.1W_100PPM) 1%
- (in symbol R0603_51K_1%_0.1W_100PPM) 1%
- (in symbol R0603_100K_1%_0.1W_100PPM) 1%
- (in symbol R0603_100R_1%_0.1W_100PPM) 1%
- (in symbol R0603_510K_1%_0.1W_100PPM) 1%
- (in symbol R0603_620K_1%_0.1W_100PPM) 1%
- (in symbol R0603_820K_1%_0.1W_100PPM) 1%

### Library data of the parts
C273 C275 C276 C279 = CC0603_100NF_50V_10%_X7R: as C235 on sheet LCL; Part Number: CC0603_100NF_50V_10%_X7R; Component Kind: Standard; Component Type: Standard; Pin Count: 2; Value: 100nF; Status: Preferred; Manufacturer Part Number: CC0603_100NF_50V_10%_X7R; Case: 0603; Mounted: Yes; Socket: No; SMD: Yes; Sense: No; Manufacturer1 Example: PHYCOMP; Manufacturer1 ComponentHeight: 0.87mm; HelpURL: \\cern.ch\dfs\Applications\Altium\Datasheets\CC0603_X7R_PHYCOMP.pdf; Author: CERN DEM JLC; CreateDate: 2007-12-03; LatestRevisionDate: 2007-12-03
C274 C280 = CC0603_100PF_50V_10%_X7R: as C236 on sheet LCL; Part Number: CC0603_100PF_50V_10%_X7R; Component Kind: Standard; Component Type: Standard; Pin Count: 2; Value: 100pF; Status: Preferred; Manufacturer Part Number: CC0603_100PF_50V_10%_X7R; Case: 0603; Mounted: Yes; Socket: No; SMD: Yes; Sense: No; Manufacturer1 Example: PHYCOMP; Manufacturer1 ComponentHeight: 0.9mm; HelpURL: \\cern.ch\dfs\Applications\Altium\Datasheets\CC0603_X7R_PHYCOMP.pdf; Author: CERN DEM JLC; CreateDate: 2012-08-15; LatestRevisionDate: 2012-08-15
C277 = CC0603_1UF_25V_10%_X7R: as C239 on sheet LCL; Part Number: CC0603_1UF_25V_10%_X7R; Component Kind: Standard; Component Type: Standard; Pin Count: 2; Value: 1uF; Status: None; Manufacturer Part Number: CC0603_1UF_25V_10%_X7R; Case: 0603; Mounted: Yes; Socket: No; SMD: Yes; Sense: No; Manufacturer1 Example: MURATA; Manufacturer1 ComponentHeight: 0.9mm; HelpURL: \\cern.ch\dfs\Applications\Altium\Datasheets\CC0603_X7R_MURATA.pdf; Author: CERN DEM JLC; CreateDate: 2011-01-18; LatestRevisionDate: 2011-01-18
C278 = CC0603_10NF_50V_10%_X7R: as C240 on sheet LCL; Part Number: CC0603_10NF_50V_10%_X7R; Component Kind: Standard; Component Type: Standard; Pin Count: 2; Value: 10nF; Status: Preferred; Manufacturer Part Number: CC0603_10NF_50V_10%_X7R; Case: 0603; Mounted: Yes; Socket: No; SMD: Yes; Sense: No; Manufacturer1 Example: PHYCOMP; Manufacturer1 ComponentHeight: 0.87mm; HelpURL: \\cern.ch\dfs\Applications\Altium\Datasheets\CC0603_X7R_PHYCOMP.pdf; Author: CERN DEM JLC; CreateDate: 2007-12-03; LatestRevisionDate: 2007-12-03
D17 = 1N4148WS: as D13 on sheet LCL; Part Number: 1N4148WS; Component Kind: Standard; Component Type: Standard; Device: 1N4148WS; PackageDescription: SODFL Diode; 1.70mm W X 1.25mm L X 1.00mm H body, IPC Medium Density; Manufacturer Part Number: 1N4148WS; Pin Count: 2; Case: SOD-323F; Mounted: Yes; Socket: No; SMD: Yes; Sense: No; ComponentHeight: 1mm; HelpURL: \\cern.ch\dfs\Applications\Altium\Datasheets\1N4148WS.pdf; Author: CERN DEM JLC; CreateDate: 2011-05-12; LatestRevisionDate: 2011-05-12
FTG9-FTG11 = FIDUCIAL_TARGET_C100-200: as FTG1 on sheet LCL; Part Number: FIDUCIAL_TARGET_C100-200; Component Kind: Standard (No BOM); Component Type: Standard (No BOM); Pin Count: 1; Family: Fiducial; Socket: No; SMD: Yes; Sense: No; Status: None; ComponentHeight: 0mm; HelpURL: Undefined; Author: CERN DEM JLC; CreateDate: 2010-02-09; LatestRevisionDate: 2012-04-04; PackageDescription: Round Fiducial Target, Top Layer, 1.0mm, Top Solder 2.0mm, Keepout =2.0mm
P6 = Header 4: Header, 4-Pin; LatestRevisionDate: 17-Jul-2002; LatestRevisionNote: Re-released for DXP Platform.; Publisher: Altium Limited
P7 = Header 6: Header, 6-Pin; LatestRevisionDate: 17-Jul-2002; LatestRevisionNote: Re-released for DXP Platform.; Publisher: Altium Limited
R109 R180 R181 R188 = R0603_10K_1%_0.1W_100PPM: as R117 on sheet LCL; Part Number: R0603_10K_1%_0.1W_100PPM; Component Kind: Standard; Component Type: Standard; Pin Count: 2; Value: 10k; Status: Preferred; Tolerance: ±1%; Manufacturer Part Number: R0603_10K_1%_0.1W_100PPM; Case: 0603; Mounted: Yes; Sense: No; Socket: No; SMD: Yes; Manufacturer1 Example: NIC COMPONENT; Manufacturer1 ComponentHeight: 0.55mm; HelpURL: \\cern.ch\dfs\Applications\Altium\Datasheets\R0603_NIC_NRC.pdf; Author: CERN DEM JLC; CreateDate: 2007-12-03; LatestRevisionDate: 2008-03-13
R110 R171 R174 R183 R189 R190 R197 = R0603_1K_1%_0.1W_100PPM: as R118 on sheet LCL; Part Number: R0603_1K_1%_0.1W_100PPM; Component Kind: Standard; Component Type: Standard; Pin Count: 2; Value: 1k; Status: Preferred; Tolerance: ±1%; Manufacturer Part Number: R0603_1K_1%_0.1W_100PPM; Case: 0603; Mounted: Yes; Sense: No; Socket: No; SMD: Yes; Manufacturer1 Example: NIC COMPONENT; Manufacturer1 ComponentHeight: 0.55mm; HelpURL: \\cern.ch\dfs\Applications\Altium\Datasheets\R0603_NIC_NRC.pdf; Author: CERN DEM JLC; CreateDate: 2007-12-03; LatestRevisionDate: 2008-03-13
R172 R173 R186 R192 R195 R196 R200 = R0603_100K_1%_0.1W_100PPM: as R120 on sheet LCL; Part Number: R0603_100K_1%_0.1W_100PPM; Component Kind: Standard; Component Type: Standard; Pin Count: 2; Value: 100k; Status: Preferred; Tolerance: ±1%; Manufacturer Part Number: R0603_100K_1%_0.1W_100PPM; Case: 0603; Mounted: Yes; Sense: No; Socket: No; SMD: Yes; Manufacturer1 Example: NIC COMPONENT; Manufacturer1 ComponentHeight: 0.55mm; HelpURL: \\cern.ch\dfs\Applications\Altium\Datasheets\R0603_NIC_NRC.pdf; Author: CERN DEM JLC; CreateDate: 2007-12-03; LatestRevisionDate: 2008-03-13
R175 R194 R199 = R0603_100R_1%_0.1W_100PPM: as R123 on sheet LCL; Part Number: R0603_100R_1%_0.1W_100PPM; Component Kind: Standard; Component Type: Standard; Pin Count: 2; Value: 100; Status: Preferred; Tolerance: ±1%; Manufacturer Part Number: R0603_100R_1%_0.1W_100PPM; Case: 0603; Mounted: Yes; Sense: No; Socket: No; SMD: Yes; Manufacturer1 Example: NIC COMPONENT; Manufacturer1 ComponentHeight: 0.55mm; HelpURL: \\cern.ch\dfs\Applications\Altium\Datasheets\R0603_NIC_NRC.pdf; Author: CERN DEM JLC; CreateDate: 2007-12-03; LatestRevisionDate: 2008-03-13
R176 R182 R201 = R0603_47K_1%_0.1W_100PPM: as R124 on sheet LCL; Part Number: R0603_47K_1%_0.1W_100PPM; Component Kind: Standard; Component Type: Standard; Pin Count: 2; Value: 47k; Status: Preferred; Tolerance: ±1%; Manufacturer Part Number: R0603_47K_1%_0.1W_100PPM; Case: 0603; Mounted: Yes; Sense: No; Socket: No; SMD: Yes; Manufacturer1 Example: NIC COMPONENT; Manufacturer1 ComponentHeight: 0.55mm; HelpURL: \\cern.ch\dfs\Applications\Altium\Datasheets\R0603_NIC_NRC.pdf; Author: CERN DEM JLC; CreateDate: 2007-12-03; LatestRevisionDate: 2008-03-13
R177 R202 = R0603_16K_1%_0.1W_100PPM: as R125 on sheet LCL; Part Number: R0603_16K_1%_0.1W_100PPM; Component Kind: Standard; Component Type: Standard; Pin Count: 2; Value: 16k; Status: Preferred; Tolerance: ±1%; Manufacturer Part Number: R0603_16K_1%_0.1W_100PPM; Case: 0603; Mounted: Yes; Sense: No; Socket: No; SMD: Yes; Manufacturer1 Example: NIC COMPONENT; Manufacturer1 ComponentHeight: 0.55mm; HelpURL: \\cern.ch\dfs\Applications\Altium\Datasheets\R0603_NIC_NRC.pdf; Author: CERN DEM JLC; CreateDate: 2007-12-03; LatestRevisionDate: 2008-03-13
R178 R203 = R0603_820K_1%_0.1W_100PPM: as R126 on sheet LCL; Part Number: R0603_820K_1%_0.1W_100PPM; Component Kind: Standard; Component Type: Standard; Pin Count: 2; Value: 820k; Status: Preferred; Tolerance: ±1%; Manufacturer Part Number: R0603_820K_1%_0.1W_100PPM; Case: 0603; Mounted: Yes; Sense: No; Socket: No; SMD: Yes; Manufacturer1 Example: NIC COMPONENT; Manufacturer1 ComponentHeight: 0.55mm; HelpURL: \\cern.ch\dfs\Applications\Altium\Datasheets\R0603_NIC_NRC.pdf; Author: CERN DEM JLC; CreateDate: 2007-12-03; LatestRevisionDate: 2008-03-13
R179 R204 = R0603_620K_1%_0.1W_100PPM: as R127 on sheet LCL; Part Number: R0603_620K_1%_0.1W_100PPM; Component Kind: Standard; Component Type: Standard; Pin Count: 2; Value: 620k; Status: Preferred; Tolerance: ±1%; Manufacturer Part Number: R0603_620K_1%_0.1W_100PPM; Case: 0603; Mounted: Yes; Sense: No; Socket: No; SMD: Yes; Manufacturer1 Example: NIC COMPONENT; Manufacturer1 ComponentHeight: 0.55mm; HelpURL: \\cern.ch\dfs\Applications\Altium\Datasheets\R0603_NIC_NRC.pdf; Author: CERN DEM JLC; CreateDate: 2007-12-03; LatestRevisionDate: 2008-03-13
R184 R187 R232 R233 = R0603_0R_JUMPER: as R115 on sheet LCL; Component Kind: Standard; Component Type: Standard; Pin Count: 2; Status: Preferred; Manufacturer Part Number: R0603_0R_JUMPER; Case: 0603; Mounted: Yes; Sense: No; Socket: No; SMD: Yes; Manufacturer1 Example: NIC COMPONENT; Manufacturer1 ComponentHeight: 0.55mm; HelpURL: \\cern.ch\dfs\Applications\Altium\Datasheets\R0603_NIC_NRC.pdf; Author: CERN DEM JLC; CreateDate: 2007-12-03; LatestRevisionDate: 2008-03-13
R185 = R0603_51K_1%_0.1W_100PPM: as R133 on sheet LCL; Part Number: R0603_51K_1%_0.1W_100PPM; Component Kind: Standard; Component Type: Standard; Pin Count: 2; Value: 51k; Status: Preferred; Tolerance: ±1%; Manufacturer Part Number: R0603_51K_1%_0.1W_100PPM; Case: 0603; Mounted: Yes; Sense: No; Socket: No; SMD: Yes; Manufacturer1 Example: NIC COMPONENT; Manufacturer1 ComponentHeight: 0.55mm; HelpURL: \\cern.ch\dfs\Applications\Altium\Datasheets\R0603_NIC_NRC.pdf; Author: CERN DEM JLC; CreateDate: 2007-12-03; LatestRevisionDate: 2008-03-13
R191 = R0603_510K_1%_0.1W_100PPM: as R139 on sheet LCL; Part Number: R0603_510K_1%_0.1W_100PPM; Component Kind: Standard; Component Type: Standard; Pin Count: 2; Value: 510k; Status: Preferred; Tolerance: ±1%; Manufacturer Part Number: R0603_510K_1%_0.1W_100PPM; Case: 0603; Mounted: Yes; Sense: No; Socket: No; SMD: Yes; Manufacturer1 Example: NIC COMPONENT; Manufacturer1 ComponentHeight: 0.55mm; HelpURL: \\cern.ch\dfs\Applications\Altium\Datasheets\R0603_NIC_NRC.pdf; Author: CERN DEM JLC; CreateDate: 2007-12-03; LatestRevisionDate: 2008-03-13
R193 = R0603_10K5_0.1%_0.063W_10PPM: as R141 on sheet LCL; Part Number: R0603_10K5_0.1%_0.063W_10PPM; Component Kind: Standard; Component Type: Standard; Pin Count: 2; Value: 10k5; Status: Not Recommended; Tolerance: ±0.1%; Manufacturer Part Number: R0603_10K5_0.1%_0.063W_10PPM; Case: 0603; Mounted: Yes; Sense: No; Socket: No; SMD: Yes; Manufacturer1 Example: TYCO HOLSWORTHY; Manufacturer1 ComponentHeight: 0.5mm; HelpURL: \\cern.ch\dfs\Applications\Altium\Datasheets\R0603_Tyco_RN73.pdf; Author: CERN DEM JLC; CreateDate: 2007-12-03; LatestRevisionDate: 2008-03-13
R198 = R0603_1K5_1%_0.1W_100PPM: as R146 on sheet LCL; Part Number: R0603_1K5_1%_0.1W_100PPM; Component Kind: Standard; Component Type: Standard; Pin Count: 2; Value: 1k5; Status: Preferred; Tolerance: ±1%; Manufacturer Part Number: R0603_1K5_1%_0.1W_100PPM; Case: 0603; Mounted: Yes; Sense: No; Socket: No; SMD: Yes; Manufacturer1 Example: NIC COMPONENT; Manufacturer1 ComponentHeight: 0.55mm; HelpURL: \\cern.ch\dfs\Applications\Altium\Datasheets\R0603_NIC_NRC.pdf; Author: CERN DEM JLC; CreateDate: 2007-12-03; LatestRevisionDate: 2008-03-13
U7 = LM6142AIMX: as U4 on sheet LCL; DatasheetVersion: Nov-2004; PackageVersion: revM, May-2009; PackageReference: M08A; PackageDescription: SOIC Narrow, 4.9 x 3.9 x 1.45mm, 8 Lead, 1.27mm Pitch; PartNumber: LM6142AIMX; RoHS: N; PinCount: 8; Code_JEDEC: MS-012-AA; Code_IPC: SOIC127P600-8; ComponentLink1Description: Manufacturer URL; ComponentLink1URL: http://www.national.com/; ComponentLink2Description: LM6142 Datasheet; ComponentLink2URL: http://www.national.com/ds/LM/LM6142.pdf; ComponentLink3Description: LM6142 Web Page; ComponentLink3URL: http://www.national.com/pf/LM/LM6142.html; ComponentLink4Description: M08A Package Page; ComponentLink4URL: http://www.national.com/packaging/folders/m08a.html
U8 = LM139AWG-SMD: as U5 on sheet LCL; DatasheetVersion: Mar-2004; PackageVersion: revD, Jul-2007; PackageReference: WG14A; PackageDescription: Cerpack, .390 x .250 x .070in, 14 Lead, .050in Pitch, Gull Wing; PartNumber: LM139AWG-SMD; RoHS: N; PinCount: 14; ComponentLink1Description: Manufacturer URL; ComponentLink1URL: http://www.national.com/; ComponentLink2Description: LM139A Datasheet; ComponentLink2URL: http://www.national.com/ds/LM/LM139AQML.pdf; ComponentLink3Description: LM139A Web Page; ComponentLink3URL: http://www.national.com/pf/LM/LM139A.html; ComponentLink4Description: WG14A Package Page; ComponentLink4URL: http://www.national.com/packaging/folders/wg14a.html

## Sheet SVPXFMC_Carrier_6U.SchDoc: Title
size 420 x 297 mm; CheckedBy: G.Kasprowicz; Author: G.Kasprowicz; CompanyName: WUT ISE; DrawnBy: F.Switakowski; Organization: WUT ISE; Address1: PW ISE; Address2: Nowowiejska 15/19 00-665 Warsaw; Revision: -; SheetNumber: -; SheetTotal: -; ModifiedBy: -; CheckedDate: -; Title2: Title2; DivGrp: WUT ISE; Designer: G.Kasprowicz; ModifiedDate: -; ProjectName: FMC SFP 4
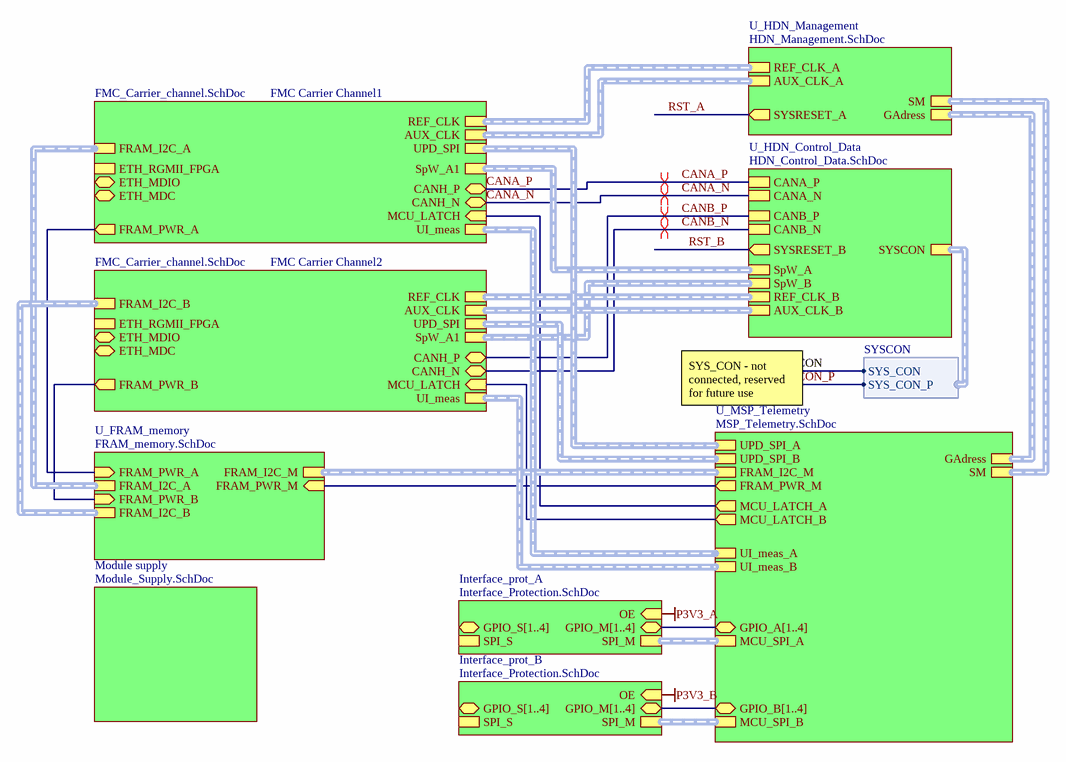
[diagram p2: SVPXFMC_Carrier_6U.SchDoc]

### Sub-sheets
FMC Carrier Channel1 = FMC_Carrier_channel.SchDoc: ETH_RGMII_FPGA (harness RGMII), ETH_MDIO (bidir), ETH_MDC (bidir), UI_meas, SpW_A1 (harness SpW), CANH_N (bidir), CANH_P (bidir), UPD_SPI, REF_CLK (harness CLK), AUX_CLK (harness CLK), FRAM_PWR_A (out), FRAM_I2C_A, MCU_LATCH (in)
FMC Carrier Channel2 = FMC_Carrier_channel.SchDoc: ETH_RGMII_FPGA (harness RGMII), ETH_MDIO (bidir), ETH_MDC (bidir), UI_meas, SpW_A1 (harness SpW), CANH_N (bidir), CANH_P (bidir), UPD_SPI, REF_CLK (harness CLK), AUX_CLK (harness CLK), FRAM_PWR_B (out), FRAM_I2C_B, MCU_LATCH (in)
Interface_prot_A = Interface_Protection.SchDoc: SPI_M (harness SPI), SPI_S (harness SPI), OE (in), GPIO_S[1..4] (bidir), GPIO_M[1..4] (bidir)
Interface_prot_B = Interface_Protection.SchDoc: SPI_M (harness SPI), SPI_S (harness SPI), OE (in), GPIO_S[1..4] (bidir), GPIO_M[1..4] (bidir)
Module supply = Module_Supply.SchDoc: no entries
U_FRAM_memory = FRAM_memory.SchDoc: FRAM_I2C_B (harness I2C), FRAM_I2C_M (harness I2C), FRAM_I2C_A (harness I2C), FRAM_PWR_A (in), FRAM_PWR_B (in), FRAM_PWR_M (in)
U_HDN_Control_Data = HDN_Control_Data.SchDoc: AUX_CLK_B (harness CLK), REF_CLK_B (harness CLK), SYSCON (harness SYSCON), SpW_A (harness SpW), SpW_B (harness SpW), SYSRESET_B (out), CANA_P, CANA_N, CANB_P, CANB_N
U_HDN_Management = HDN_Management.SchDoc: AUX_CLK_A (harness CLK), REF_CLK_A (harness CLK), GAdress (harness GAdress), SM (harness SM), SYSRESET_A (out)
U_MSP_Telemetry = MSP_Telemetry.SchDoc: FRAM_I2C_M (harness I2C), MCU_SPI_A (harness SPI), MCU_SPI_B (harness SPI), MCU_LATCH_B (out), MCU_LATCH_A (out), SM (harness SM), GAdress (harness GAdress), GPIO_A[1..4] (bidir), GPIO_B[1..4] (bidir), FRAM_PWR_M (out), UPD_SPI_A, UPD_SPI_B, UI_meas_A, UI_meas_B

### Harnesses
SYSCON: SYS_CON, SYS_CON_P

### Nets
CANA_N: sheet FMC Carrier Channel1/CANH_N, sheet U_HDN_Control_Data/CANA_N
CANA_P: sheet FMC Carrier Channel1/CANH_P, sheet U_HDN_Control_Data/CANA_P
CANB_N: sheet FMC Carrier Channel2/CANH_N, sheet U_HDN_Control_Data/CANB_N
CANB_P: sheet FMC Carrier Channel2/CANH_P, sheet U_HDN_Control_Data/CANB_P
NetD3_2: sheet FMC Carrier Channel1/FRAM_PWR_A, sheet U_FRAM_memory/FRAM_PWR_A
NetD4_2: sheet FMC Carrier Channel2/FRAM_PWR_B, sheet U_FRAM_memory/FRAM_PWR_B
NetD5_2: sheet U_MSP_Telemetry/FRAM_PWR_M, sheet U_FRAM_memory/FRAM_PWR_M
NetIC29_57: sheet FMC Carrier Channel1/MCU_LATCH, sheet U_MSP_Telemetry/MCU_LATCH_A
NetIC29_58: sheet FMC Carrier Channel2/MCU_LATCH, sheet U_MSP_Telemetry/MCU_LATCH_B

### Buses and harness runs
bus sheet Interface_prot_A/GPIO_M[1..4] = sheet U_MSP_Telemetry/GPIO_A[1..4]
bus sheet Interface_prot_B/GPIO_M[1..4] = sheet U_MSP_Telemetry/GPIO_B[1..4]
harness sheet FMC Carrier Channel1/AUX_CLK = sheet U_HDN_Management/AUX_CLK_A
harness sheet FMC Carrier Channel1/FRAM_I2C_A = sheet U_FRAM_memory/FRAM_I2C_A
harness sheet FMC Carrier Channel1/REF_CLK = sheet U_HDN_Management/REF_CLK_A
harness sheet FMC Carrier Channel1/SpW_A1 = sheet U_HDN_Control_Data/SpW_A
harness sheet FMC Carrier Channel1/UI_meas = sheet U_MSP_Telemetry/UI_meas_A
harness sheet FMC Carrier Channel1/UPD_SPI = sheet U_MSP_Telemetry/UPD_SPI_A
harness sheet FMC Carrier Channel2/AUX_CLK = sheet U_HDN_Control_Data/AUX_CLK_B
harness sheet FMC Carrier Channel2/FRAM_I2C_B = sheet U_FRAM_memory/FRAM_I2C_B
harness sheet FMC Carrier Channel2/REF_CLK = sheet U_HDN_Control_Data/REF_CLK_B
harness sheet FMC Carrier Channel2/SpW_A1 = sheet U_HDN_Control_Data/SpW_B
harness sheet FMC Carrier Channel2/UI_meas = sheet U_MSP_Telemetry/UI_meas_B
harness sheet FMC Carrier Channel2/UPD_SPI = sheet U_MSP_Telemetry/UPD_SPI_B
harness sheet Interface_prot_A/SPI_M = sheet U_MSP_Telemetry/MCU_SPI_A
harness sheet Interface_prot_B/SPI_M = sheet U_MSP_Telemetry/MCU_SPI_B
harness sheet U_FRAM_memory/FRAM_I2C_M = sheet U_MSP_Telemetry/FRAM_I2C_M
harness sheet U_HDN_Management/GAdress = sheet U_MSP_Telemetry/GAdress
harness sheet U_HDN_Management/SM = sheet U_MSP_Telemetry/SM

### Layout directives
differential pair: CANA_N, CANA_P, CANB_N, CANB_P

### Notes on the sheet
- SYS_CON - not connected, reserved  for future use
- Project/Equipment
- Document
- Designer
- Drawn by
- Check.by
- Copyright WUT ISE 2018.
  This documentation describes Open Hardware and is licensed under the CERN OHL v.1.1. You may redistribute and modify this documentation under the terms of the CERN OHL v.1.1. (http://ohwr.org/CERNOHL). This documentation is distributed WITHOUT ANY EXPRESS OR IMPLIED WARRANTY, INCLUDING OF MERCHANTABILITY, SATISFACTORY QUALITY AND FITNESS FOR A PARTICULAR PURPOSE. Please see the CERN OHL v.1.1 for applicable conditions.
- File
- Last Mod.
- Print Date
- Sheet
- Size
- A3
- of
- Rev

## Sheet FMC_Carrier_channel.SchDoc
size A3
Used 2 times, as channels FMC Carrier Channel1, FMC Carrier Channel2. Parts and nets are listed once, with the designators drawn on the sheet.
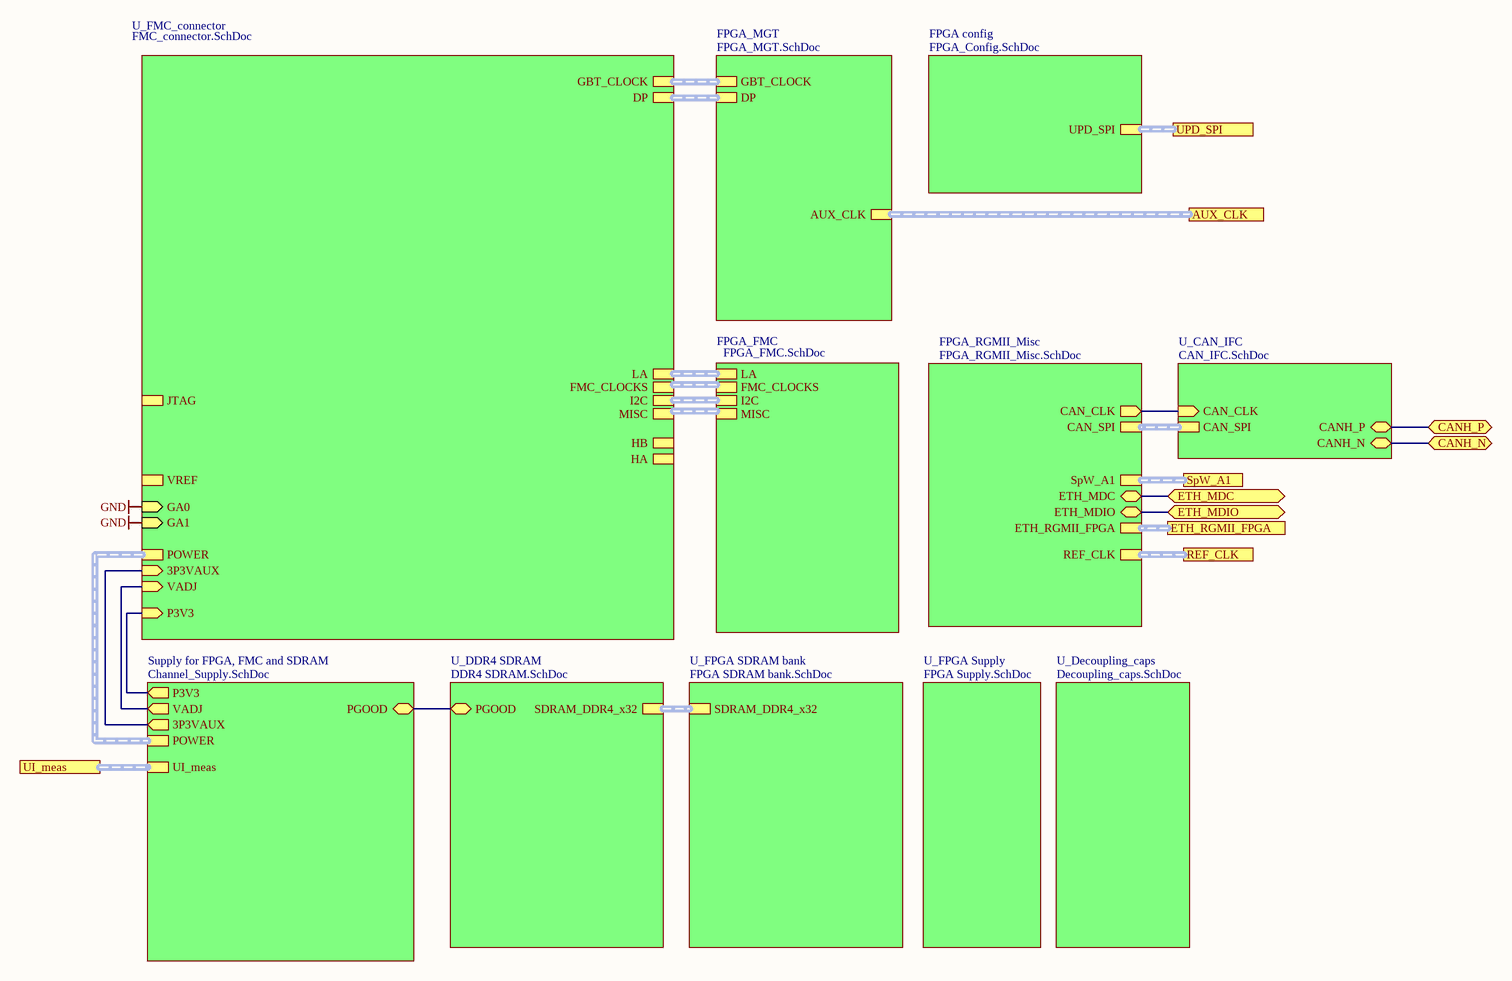
[diagram p3: FMC_Carrier_channel.SchDoc]

### Sub-sheets
FPGA config = FPGA_Config.SchDoc: UPD_SPI (harness UPD_SPI)
FPGA_FMC = FPGA_FMC.SchDoc: LA (harness FMC_J1_LA), FMC_CLOCKS (harness FMC_CLOCKS), I2C (harness I2C), MISC (harness MISC)
FPGA_MGT = FPGA_MGT.SchDoc: GBT_CLOCK, DP, AUX_CLK (harness CLK)
FPGA_RGMII_Misc = FPGA_RGMII_Misc.SchDoc: CAN_CLK (out), CAN_SPI, SpW_A1 (harness SpW), ETH_MDC (bidir), ETH_MDIO (bidir), ETH_RGMII_FPGA (harness RGMII), REF_CLK (harness CLK)
Supply for FPGA, FMC and SDRAM = Channel_Supply.SchDoc: P3V3 (out), VADJ (out), 3P3VAUX (out), POWER, PGOOD (bidir), UI_meas (harness Harness)
U_CAN_IFC = CAN_IFC.SchDoc: CANH_P (bidir), CANH_N (bidir), CAN_CLK (in), CAN_SPI (harness CAN_SPI)
U_DDR4 SDRAM = DDR4 SDRAM.SchDoc: PGOOD (bidir), SDRAM_DDR4_x32 (harness DDR4_x32)
U_Decoupling_caps = Decoupling_caps.SchDoc: no entries
U_FMC_connector = FMC_connector.SchDoc: DP (harness FMC_J1_DP), LA (harness FMC_J1_LA), HA (harness FMC_J1_HA), HB (harness FMC_J1_HB), MISC (harness MISC), POWER (harness FMC_J1_POWER), JTAG (harness FMC_J1_JTAG), I2C (harness I2C), FMC_CLOCKS (harness FMC_CLOCKS), VREF (harness FMC_J1_VREF), GA0 (in), GA1 (in), 3P3VAUX (in), GBT_CLOCK (harness GBT_CLOCK), VADJ (in), P3V3 (in)
U_FPGA SDRAM bank = FPGA SDRAM bank.SchDoc: SDRAM_DDR4_x32 (harness DDR4_x32)
U_FPGA Supply = FPGA Supply.SchDoc: no entries

### Ports
AUX_CLK (harness CLK), CANH_N (bidir), CANH_P (bidir), ETH_MDC (bidir), ETH_MDIO (bidir), ETH_RGMII_FPGA (harness RGMII), REF_CLK (harness CLK), SpW_A1 (harness SpW), UI_meas, UPD_SPI

### Nets
GND: sheet U_FMC_connector/GA0, sheet U_FMC_connector/GA1
CANH_N: port CANH_N, sheet U_CAN_IFC/CANH_N
CANH_P: port CANH_P, sheet U_CAN_IFC/CANH_P
ETH_MDC: port ETH_MDC, sheet FPGA_RGMII_Misc/ETH_MDC
ETH_MDIO: port ETH_MDIO, sheet FPGA_RGMII_Misc/ETH_MDIO
(unnamed): sheet U_FMC_connector/3P3VAUX, sheet Supply for FPGA, FMC and SDRAM/3P3VAUX
(unnamed): sheet U_FMC_connector/VADJ, sheet Supply for FPGA, FMC and SDRAM/VADJ
(unnamed): sheet U_FMC_connector/P3V3, sheet Supply for FPGA, FMC and SDRAM/P3V3
(unnamed): sheet FPGA_RGMII_Misc/CAN_CLK, sheet U_CAN_IFC/CAN_CLK
(unnamed): sheet Supply for FPGA, FMC and SDRAM/PGOOD, sheet U_DDR4 SDRAM/PGOOD

### Channels
FMC Carrier Channel1: ports CANH_N=CANA_N CANH_P=CANA_P ETH_MDC=MDC_FPGA_RGMII_Misc ETH_MDIO=MDIO_FPGA_RGMII_Misc
FMC Carrier Channel2: ports CANH_N=CANB_N CANH_P=CANB_P ETH_MDC=MDC_FPGA_RGMII_Misc ETH_MDIO=MDIO_FPGA_RGMII_Misc

### Buses and harness runs
harness port AUX_CLK = sheet FPGA_MGT/AUX_CLK
harness port ETH_RGMII_FPGA = sheet FPGA_RGMII_Misc/ETH_RGMII_FPGA
harness port REF_CLK = sheet FPGA_RGMII_Misc/REF_CLK
harness port SpW_A1 = sheet FPGA_RGMII_Misc/SpW_A1
harness port UI_meas = sheet Supply for FPGA, FMC and SDRAM/UI_meas
harness port UPD_SPI = sheet FPGA config/UPD_SPI
harness sheet FPGA_FMC/I2C = sheet U_FMC_connector/I2C
harness sheet FPGA_FMC/LA = sheet U_FMC_connector/LA
harness sheet FPGA_MGT/DP = sheet U_FMC_connector/DP
harness sheet FPGA_MGT/GBT_CLOCK = sheet U_FMC_connector/GBT_CLOCK
harness sheet FPGA_RGMII_Misc/CAN_SPI = sheet U_CAN_IFC/CAN_SPI
harness sheet Supply for FPGA, FMC and SDRAM/POWER = sheet U_FMC_connector/POWER
harness sheet U_DDR4 SDRAM/SDRAM_DDR4_x32 = sheet U_FPGA SDRAM bank/SDRAM_DDR4_x32